# EAGLE schematic tb6612-breakout (EAGLE 7.5.0)
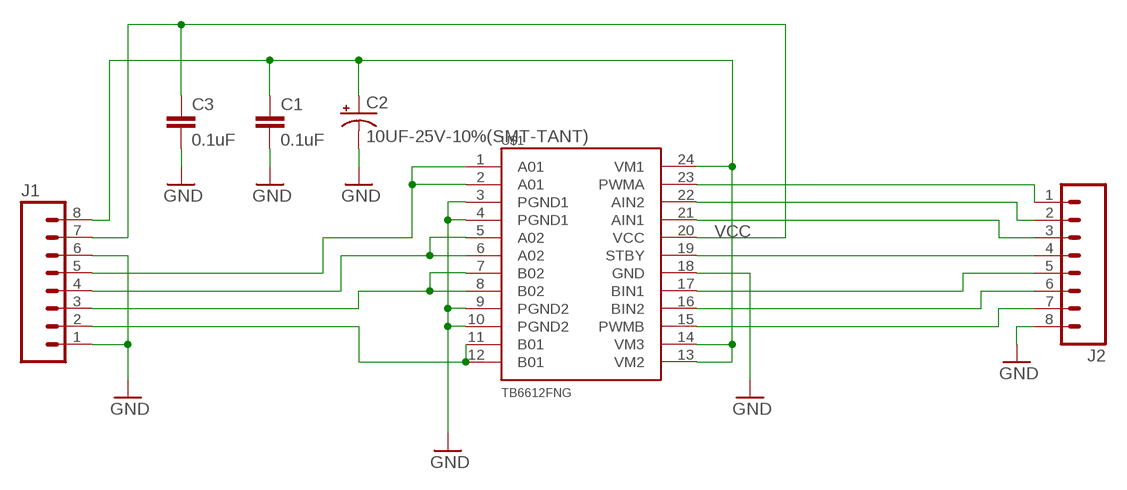
[diagram p0: schematic, sheet 1]

## Parts
C1  0.1uF  0.1UF-25V(+80/-20%)(0603)  [0603-CAP]
C2  10UF-25V-10%(SMT-TANT)  [EIA6032-NOM]
C3  0.1uF  0.1UF-25V(+80/-20%)(0603)  [0603-CAP]
J1  M08SILK_FEMALE_PTH  [1X08]
J2  M08SILK_FEMALE_PTH  [1X08]
U$1  TB6612FNG  [SSOP24]

## Nets
GND: C1.2 C2.C(-) C3.2 J1.1 J1.6 J2.8 U$1.3(PGND1) U$1.4(PGND1) U$1.9(PGND2) U$1.10(PGND2) U$1.18(GND)
N$1: J2.1 U$1.23(PWMA)
N$2: J2.2 U$1.22(AIN2)
N$3: J2.3 U$1.21(AIN1)
N$4: J2.4 U$1.19(STBY)
N$5: J2.5 U$1.17(BIN1)
N$6: J2.6 U$1.16(BIN2)
N$7: J2.7 U$1.15(PWMB)
N$8: J1.2 U$1.11(B01) U$1.12(B01)
N$9: J1.3 U$1.7(B02) U$1.8(B02)
N$10: J1.4 U$1.5(A02) U$1.6(A02)
N$12: J1.5 U$1.1(A01) U$1.2(A01)
N$13: C1.1 C2.A(+) J1.8 U$1.13(VM2) U$1.14(VM3) U$1.24(VM1)
VCC: C3.1 J1.7 U$1.20(VCC)

## Library data of the parts
C1 C3 = SparkFun-Capacitors:0.1UF-25V(+80/-20%)(0603): CAP-00810 Ceramic Standard decoupling cap; PROD_ID: CAP-00810
C2 = SparkFun-Capacitors:10UF-25V-10%(SMT-TANT): http://www.digikey.com/product-detail/en/T491C106K025AT7280/399-10159-2-ND/3759638; PROD_ID: CAP-12984
J1 J2 = SparkFun-Connectors:M08: Header 8 Standard 8-pin 0.1" header. Use with straight break away headers (SKU : PRT-00116), right angle break away headers (PRT-00553), swiss pins (PRT-00743), machine pins (PRT-00117), and female headers (PRT-00115).; PROD_ID: CONN-08438
U$1 = SparkFun-PowerIC:TB6612FNG: Toshiba 1A dual motor driver IC-09363; PROD_ID: IC-09363